# Altium schematic sheet AT short bus ( 7 x 4.2 inches).schdoc: AT short bus ( 7 x 4.2 inches)
size A; Organization: Organization; Address1: Address1; Address2: Address2; Address3: Address3; Address4: Address4; DocumentNumber: 1; Revision: 0; SheetNumber: 2; SheetTotal: 2
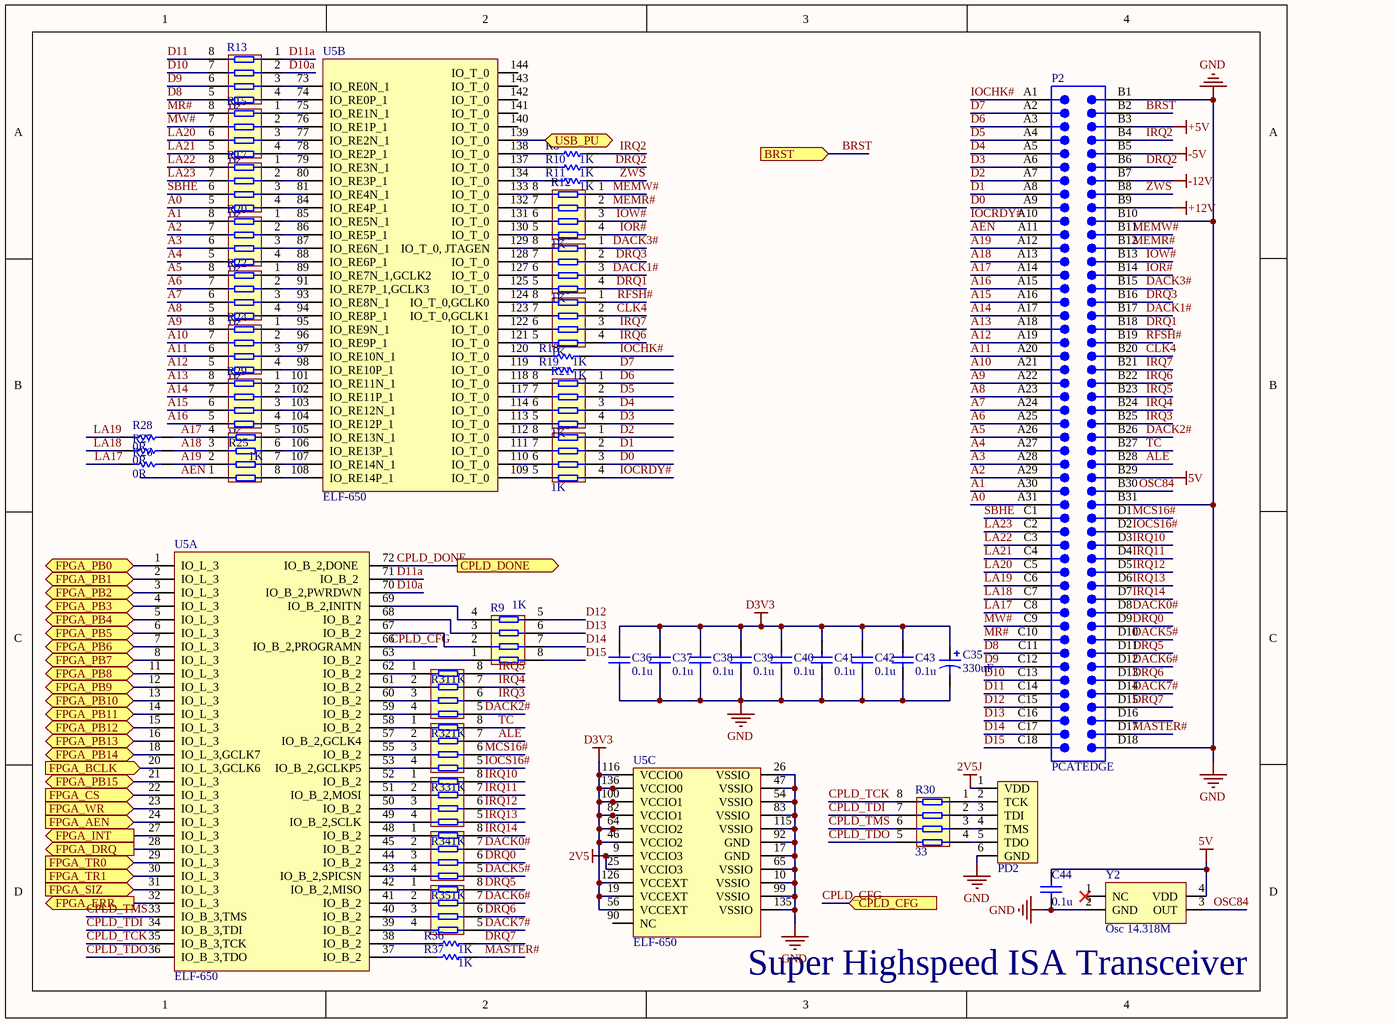
[diagram p0: AT short bus ( 7 x 4.2 inches).schdoc]

## Parts
C35  value 330uF  [TanCap-1210]  (hidden comment: 330u)
C36  value 0.1u  [0603C]  (hidden comment: Cap)
C37  value 0.1u  [0603C]  (hidden comment: Cap)
C38  value 0.1u  [0603C]  (hidden comment: Cap)
C39  value 0.1u  [0603C]  (hidden comment: Cap)
C40  value 0.1u  [0603C]  (hidden comment: Cap)
C41  value 0.1u  [0603C]  (hidden comment: Cap)
C42  value 0.1u  [0603C]  (hidden comment: Cap)
C43  value 0.1u  [0603C]  (hidden comment: Cap)
C44  value 0.1u  [0603C]  (hidden comment: Cap)
P2  PCATEDGE  [PCATEDGE]
PD2  JTAG  [DBGP7]  (value not drawn)
R8  value 1K  [0603R]  (hidden comment: Res1)
R9  1K  [YC164]
R10  value 1K  [0603R]  (hidden comment: Res1)
R11  value 1K  [0603R]  (hidden comment: Res1)
R12  1K  [YC164]
R13  1K  [YC164]
R14  1K  [YC164]
R15  1K  [YC164]
R16  1K  [YC164]
R17  1K  [YC164]
R18  value 1K  [0603R]  (hidden comment: Res1)
R19  value 1K  [0603R]  (hidden comment: Res1)
R20  1K  [YC164]
R21  1K  [YC164]
R22  1K  [YC164]
R23  1K  [YC164]
R24  1K  [YC164]
R25  1K  [YC164]
R26  value 0R  [0603R]  (hidden comment: Res1)
R27  value 0R  [0603R]  (hidden comment: Res1)
R28  value 0R  [0603R]  (hidden comment: Res1)
R29  1K  [YC164]
R30  33  [YC164]
R31  1K  [YC164]
R32  1K  [YC164]
R33  1K  [YC164]
R34  1K  [YC164]
R35  1K  [YC164]
R36  value 1K  [0603R]  (hidden comment: Res1)
R37  value 1K  [0603R]  (hidden comment: Res1)
U5  ELF-650  [LQFP144-1]  (parts A,B,C of 3)
Y2  Osc 14.318M  [XTAL-3225]

## Ports
BRST (in), CPLD_CFG (in), CPLD_DONE (out), FPGA_AEN (in), FPGA_BCLK (in), FPGA_CS (in), FPGA_DRQ (out), FPGA_ERR (out), FPGA_INT (out), FPGA_PB0 (bidir), FPGA_PB1 (bidir), FPGA_PB2 (bidir), FPGA_PB3 (bidir), FPGA_PB4 (bidir), FPGA_PB5 (bidir), FPGA_PB6 (bidir), FPGA_PB7 (bidir), FPGA_PB8 (bidir), FPGA_PB9 (bidir), FPGA_PB10 (bidir), FPGA_PB11 (bidir), FPGA_PB12 (bidir), FPGA_PB13 (bidir), FPGA_PB14 (bidir), FPGA_PB15 (bidir), FPGA_SIZ (in), FPGA_TR0 (in), FPGA_TR1 (in), FPGA_WR (in), USB_PU (bidir)

## Nets
2V5: U5.9(VCCIO3) U5.25(VCCIO3)
2V5J: PD2.1(VDD)
5V: C44.2 P2.B29 Y2.4(VDD)
+5V: P2.B3
+12V: P2.B9
-5V: P2.B5
-12V: P2.B7
D3V3: C35.1 C36.1 C37.1 C38.1 C39.1 C40.1 C41.1 C42.1 C43.1 U5.19(VCCEXT) U5.46(VCCIO2) U5.56(VCCEXT) U5.64(VCCIO2) U5.82(VCCIO1) U5.100(VCCIO1) U5.116(VCCIO0) U5.126(VCCEXT) U5.136(VCCIO0)
GND: C35.2 C36.2 C37.2 C38.2 C39.2 C40.2 C41.2 C42.2 C43.2 C44.1 P2.B1 P2.B10 P2.B31 P2.D18 PD2.6(GND) U5.10(VSSIO) U5.17(GND) U5.26(VSSIO) U5.47(VSSIO) U5.54(VSSIO) U5.65(VSSIO) U5.83(VSSIO) U5.92(GND) U5.99(VSSIO) U5.115(VSSIO) U5.135(VSSIO) Y2.2(GND)
A0: P2.A31 R17.5
A1: P2.A30 R20.8
A2: P2.A29 R20.7
A3: P2.A28 R20.6
A4: P2.A27 R20.5
A5: P2.A26 R22.8
A6: P2.A25 R22.7
A7: P2.A24 R22.6
A8: P2.A23 R22.5
A9: P2.A22 R24.8
A10: P2.A21 R24.7
A11: P2.A20 R24.6
A12: P2.A19 R24.5
A13: P2.A18 R29.8
A14: P2.A17 R29.7
A15: P2.A16 R29.6
A16: P2.A15 R29.5
A17: P2.A14 R25.4 R28.2
A18: P2.A13 R25.3 R27.2
A19: P2.A12 R25.2 R26.2
AEN: P2.A11 R25.1
ALE: P2.B28 R32.7
BRST: P2.B2 ; port BRST
CLK4: P2.B20 R16.2
CPLD_CFG: U5.66(IO_B_2,PROGRAMN) ; port CPLD_CFG
CPLD_DONE: U5.72(IO_B_2,DONE) ; port CPLD_DONE
CPLD_TCK: R30.8 U5.35(IO_B_3,TCK)
CPLD_TDI: R30.7 U5.34(IO_B_3,TDI)
CPLD_TDO: R30.5 U5.36(IO_B_3,TDO)
CPLD_TMS: R30.6 U5.33(IO_B_3,TMS)
D0: P2.A9 R23.3
D1: P2.A8 R23.2
D2: P2.A7 R23.1
D3: P2.A6 R21.4
D4: P2.A5 R21.3
D5: P2.A4 R21.2
D6: P2.A3 R21.1
D7: P2.A2 R19.1
D8: P2.C11 R13.5
D9: P2.C12 R13.6
D10: P2.C13 R13.7
D10a: R13.2 U5.70(IO_B_2,PWRDWN)
D11: P2.C14 R13.8
D11a: R13.1 U5.71(IO_B_2)
D12: P2.C15 R9.5
D13: P2.C16 R9.6
D14: P2.C17 R9.7
D15: P2.C18 R9.8
DACK0#: P2.D8 R34.7
DACK1#: P2.B17 R14.3
DACK2#: P2.B26 R31.5
DACK3#: P2.B15 R14.1
DACK5#: P2.D10 R34.5
DACK6#: P2.D12 R35.7
DACK7#: P2.D14 R35.5
DRQ0: P2.D9 R34.6
DRQ1: P2.B18 R14.4
DRQ2: P2.B6 R10.1
DRQ3: P2.B16 R14.2
DRQ5: P2.D11 R35.8
DRQ6: P2.D13 R35.6
DRQ7: P2.D15 R36.1
FPGA_AEN: U5.24(IO_L_3) ; port FPGA_AEN
FPGA_BCLK: U5.20(IO_L_3,GCLK6) ; port FPGA_BCLK
FPGA_CS: U5.22(IO_L_3) ; port FPGA_CS
FPGA_DRQ: U5.28(IO_L_3) ; port FPGA_DRQ
FPGA_ERR: U5.32(IO_L_3) ; port FPGA_ERR
FPGA_INT: U5.27(IO_L_3) ; port FPGA_INT
FPGA_PB0: U5.1(IO_L_3) ; port FPGA_PB0
FPGA_PB1: U5.2(IO_L_3) ; port FPGA_PB1
FPGA_PB2: U5.3(IO_L_3) ; port FPGA_PB2
FPGA_PB3: U5.4(IO_L_3) ; port FPGA_PB3
FPGA_PB4: U5.5(IO_L_3) ; port FPGA_PB4
FPGA_PB5: U5.6(IO_L_3) ; port FPGA_PB5
FPGA_PB6: U5.7(IO_L_3) ; port FPGA_PB6
FPGA_PB7: U5.8(IO_L_3) ; port FPGA_PB7
FPGA_PB8: U5.11(IO_L_3) ; port FPGA_PB8
FPGA_PB9: U5.12(IO_L_3) ; port FPGA_PB9
FPGA_PB10: U5.13(IO_L_3) ; port FPGA_PB10
FPGA_PB11: U5.14(IO_L_3) ; port FPGA_PB11
FPGA_PB12: U5.15(IO_L_3) ; port FPGA_PB12
FPGA_PB13: U5.16(IO_L_3) ; port FPGA_PB13
FPGA_PB14: U5.18(IO_L_3,GCLK7) ; port FPGA_PB14
FPGA_PB15: U5.21(IO_L_3) ; port FPGA_PB15
FPGA_SIZ: U5.31(IO_L_3) ; port FPGA_SIZ
FPGA_TR0: U5.29(IO_L_3) ; port FPGA_TR0
FPGA_TR1: U5.30(IO_L_3) ; port FPGA_TR1
FPGA_WR: U5.23(IO_L_3) ; port FPGA_WR
IOCHK#: P2.A1 R18.1
IOCRDY#: P2.A10 R23.4
IOCS16#: P2.D2 R32.5
IOR#: P2.B14 R12.4
IOW#: P2.B13 R12.3
IRQ2: P2.B4 R8.1
IRQ3: P2.B25 R31.6
IRQ4: P2.B24 R31.7
IRQ5: P2.B23 R31.8
IRQ6: P2.B22 R16.4
IRQ7: P2.B21 R16.3
IRQ10: P2.D3 R33.8
IRQ11: P2.D4 R33.7
IRQ12: P2.D5 R33.6
IRQ13: P2.D6 R33.5
IRQ14: P2.D7 R34.8
LA17: P2.C8 R26.1
LA18: P2.C7 R27.1
LA19: P2.C6 R28.1
LA20: P2.C5 R15.6
LA21: P2.C4 R15.5
LA22: P2.C3 R17.8
LA23: P2.C2 R17.7
MASTER#: P2.D17 R37.1
MCS16#: P2.D1 R32.6
MEMR#: P2.B12 R12.2
MEMW#: P2.B11 R12.1
MR#: P2.C10 R15.8
MW#: P2.C9 R15.7
OSC84: P2.B30 Y2.3(OUT)
RFSH#: P2.B19 R16.1
SBHE: P2.C1 R17.6
TC: P2.B27 R32.8
USB_PU: U5.139(IO_T_0) ; port USB_PU
ZWS: P2.B8 R11.1
NetPD2_2: PD2.2(TCK) R30.1
NetPD2_3: PD2.3(TDI) R30.2
NetPD2_4: PD2.4(TMS) R30.3
NetPD2_5: PD2.5(TDO) R30.4
NetR8_2: R8.2 U5.138(IO_T_0)
NetR9_1: R9.1 U5.63(IO_B_2)
NetR9_2: R9.2 U5.67(IO_B_2)
NetR9_3: R9.3 U5.68(IO_B_2)
NetR9_4: R9.4 U5.69(IO_B_2,INITN)
NetR10_2: R10.2 U5.137(IO_T_0)
NetR11_2: R11.2 U5.134(IO_T_0)
NetR12_5: R12.5 U5.130(IO_T_0)
NetR12_6: R12.6 U5.131(IO_T_0)
NetR12_7: R12.7 U5.132(IO_T_0)
NetR12_8: R12.8 U5.133(IO_T_0)
NetR13_3: R13.3 U5.73(IO_RE0N_1)
NetR13_4: R13.4 U5.74(IO_RE0P_1)
NetR14_5: R14.5 U5.125(IO_T_0)
NetR14_6: R14.6 U5.127(IO_T_0)
NetR14_7: R14.7 U5.128(IO_T_0)
NetR14_8: R14.8 U5.129(IO_T_0,_JTAGEN)
NetR15_1: R15.1 U5.75(IO_RE1N_1)
NetR15_2: R15.2 U5.76(IO_RE1P_1)
NetR15_3: R15.3 U5.77(IO_RE2N_1)
NetR15_4: R15.4 U5.78(IO_RE2P_1)
NetR16_5: R16.5 U5.121(IO_T_0)
NetR16_6: R16.6 U5.122(IO_T_0)
NetR16_7: R16.7 U5.123(IO_T_0,GCLK1)
NetR16_8: R16.8 U5.124(IO_T_0,GCLK0)
NetR17_1: R17.1 U5.79(IO_RE3N_1)
NetR17_2: R17.2 U5.80(IO_RE3P_1)
NetR17_3: R17.3 U5.81(IO_RE4N_1)
NetR17_4: R17.4 U5.84(IO_RE4P_1)
NetR18_2: R18.2 U5.120(IO_T_0)
NetR19_2: R19.2 U5.119(IO_T_0)
NetR20_1: R20.1 U5.85(IO_RE5N_1)
NetR20_2: R20.2 U5.86(IO_RE5P_1)
NetR20_3: R20.3 U5.87(IO_RE6N_1)
NetR20_4: R20.4 U5.88(IO_RE6P_1)
NetR21_5: R21.5 U5.113(IO_T_0)
NetR21_6: R21.6 U5.114(IO_T_0)
NetR21_7: R21.7 U5.117(IO_T_0)
NetR21_8: R21.8 U5.118(IO_T_0)
NetR22_1: R22.1 U5.89(IO_RE7N_1,GCLK2)
NetR22_2: R22.2 U5.91(IO_RE7P_1,GCLK3)
NetR22_3: R22.3 U5.93(IO_RE8N_1)
NetR22_4: R22.4 U5.94(IO_RE8P_1)
NetR23_5: R23.5 U5.109(IO_T_0)
NetR23_6: R23.6 U5.110(IO_T_0)
NetR23_7: R23.7 U5.111(IO_T_0)
NetR23_8: R23.8 U5.112(IO_T_0)
NetR24_1: R24.1 U5.95(IO_RE9N_1)
NetR24_2: R24.2 U5.96(IO_RE9P_1)
NetR24_3: R24.3 U5.97(IO_RE10N_1)
NetR24_4: R24.4 U5.98(IO_RE10P_1)
NetR25_5: R25.5 U5.105(IO_RE13N_1)
NetR25_6: R25.6 U5.106(IO_RE13P_1)
NetR25_7: R25.7 U5.107(IO_RE14N_1)
NetR25_8: R25.8 U5.108(IO_RE14P_1)
NetR29_1: R29.1 U5.101(IO_RE11N_1)
NetR29_2: R29.2 U5.102(IO_RE11P_1)
NetR29_3: R29.3 U5.103(IO_RE12N_1)
NetR29_4: R29.4 U5.104(IO_RE12P_1)
NetR31_1: R31.1 U5.62(IO_B_2)
NetR31_2: R31.2 U5.61(IO_B_2)
NetR31_3: R31.3 U5.60(IO_B_2)
NetR31_4: R31.4 U5.59(IO_B_2)
NetR32_1: R32.1 U5.58(IO_B_2)
NetR32_2: R32.2 U5.57(IO_B_2,GCLK4)
NetR32_3: R32.3 U5.55(IO_B_2)
NetR32_4: R32.4 U5.53(IO_B_2,GCLKP5)
NetR33_1: R33.1 U5.52(IO_B_2)
NetR33_2: R33.2 U5.51(IO_B_2,MOSI)
NetR33_3: R33.3 U5.50(IO_B_2)
NetR33_4: R33.4 U5.49(IO_B_2,SCLK)
NetR34_1: R34.1 U5.48(IO_B_2)
NetR34_2: R34.2 U5.45(IO_B_2)
NetR34_3: R34.3 U5.44(IO_B_2)
NetR34_4: R34.4 U5.43(IO_B_2,SPICSN)
NetR35_1: R35.1 U5.42(IO_B_2,MISO)
NetR35_2: R35.2 U5.41(IO_B_2)
NetR35_3: R35.3 U5.40(IO_B_2)
NetR35_4: R35.4 U5.39(IO_B_2)
NetR36_2: R36.2 U5.38(IO_B_2)
NetR37_2: R37.2 U5.37(IO_B_2)

Not connected (* = marked no-connect by the designer): P2 D16; U5 90(NC_) 140(IO_T_0) 141(IO_T_0) 142(IO_T_0) 143(IO_T_0) 144(IO_T_0); Y2 1(NC)*

## Notes on the sheet
- Super Highspeed ISA Transceiver

## Library data of the parts
C35 = Cap Pol1: Polarized Capacitor (Radial); Published: 8-Jun-2000; LatestRevisionDate: 17-Jul-2002; LatestRevisionNote: Re-released for DXP Platform.; PackageReference: RB7.6-15; Publisher: Altium Limited; PackageDescription: Polarized Capacitor (Radial); 2 Leads
C36-C44 = Cap: Capacitor; Published: 8-Jun-2000; LatestRevisionDate: 17-Jul-2002; LatestRevisionNote: Re-released for DXP Platform.; PackageReference: RAD-0.3; Publisher: Altium Limited; PackageDescription: Radial Cap, Thru-Hole; 2 Leads; 0.3 in Pin Spacing
P2 = PCATEDGE: Card, 98-Position; Text Field6: Alternate Layout Available; Text Field7: Published 14-Feb-2002
R8 R10 R11 R18 R19 R26-R28 R36 R37 = Res1: Resistor; Published: 8-Jun-2000; LatestRevisionDate: 17-Jul-2002; LatestRevisionNote: Re-released for DXP Platform.; PackageReference: AXIAL-0.3; Publisher: Altium Limited; PackageDescription: Axial Device, Thru-Hole; 2 Leads; 0.3 in Pin Spacing
R9 R12-R17 R20-R25 R29-R35 = ResPak-8P4R
U5 = EF1A650LQ144: GP CPLD
Y2 = OSC